# Altium schematic sheet led_RGB.SchDoc
size A4
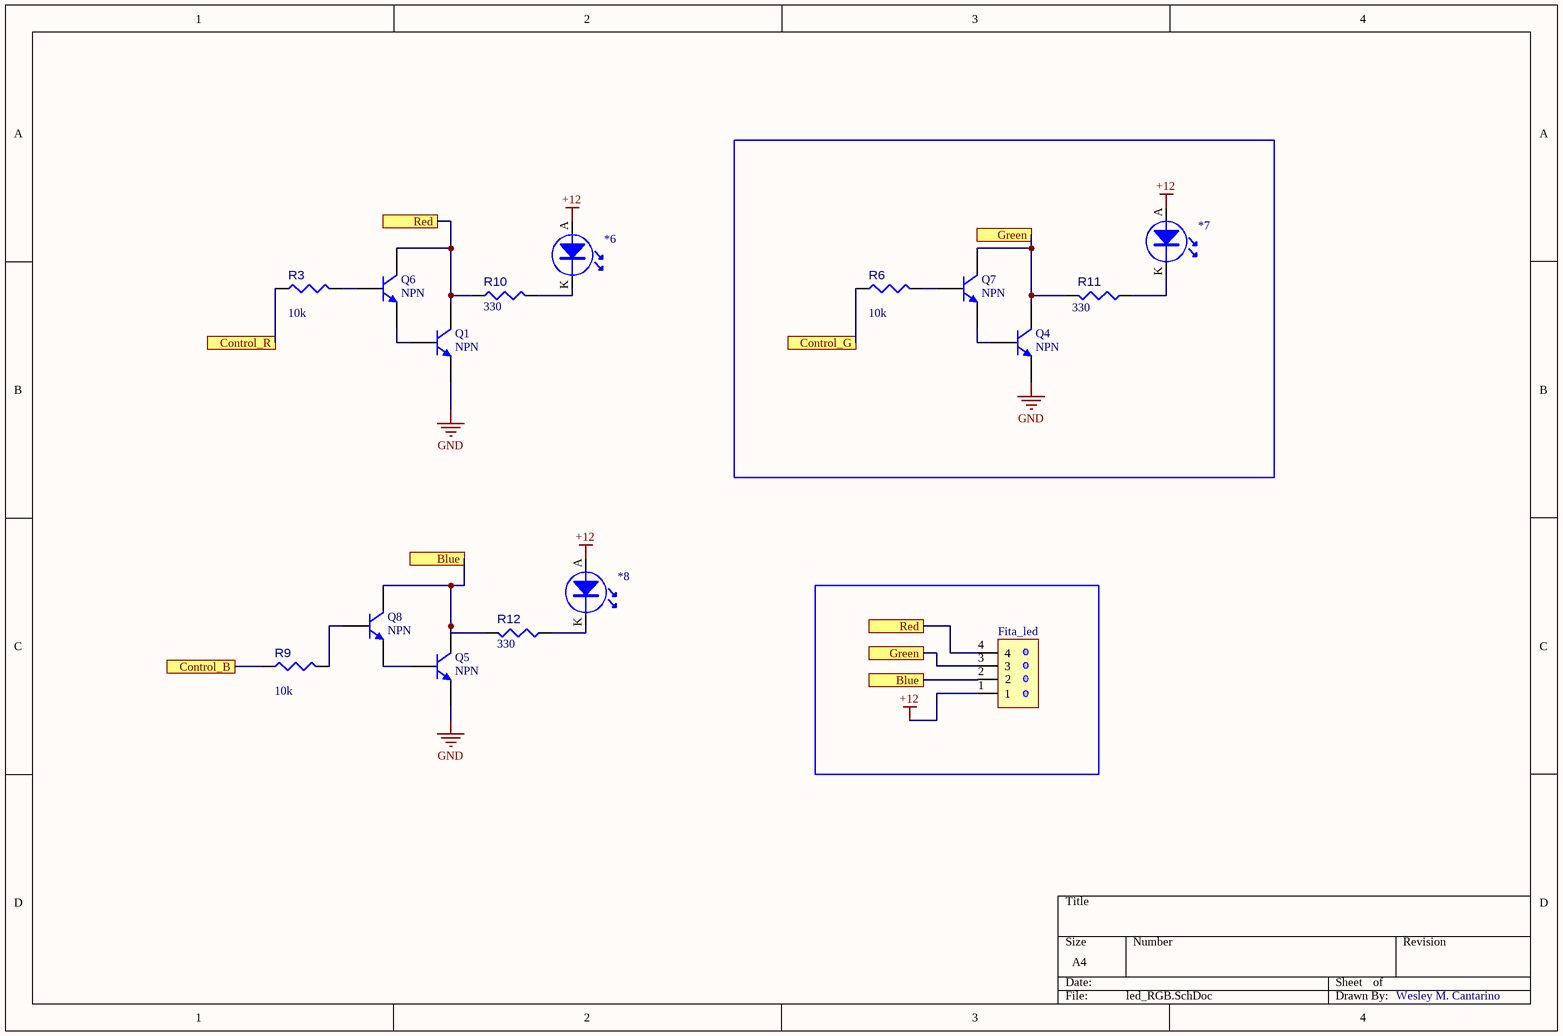
[diagram p0: led_RGB.SchDoc]

## Parts
*6  LED_AXIAL_5MM  [HEADER_1X2]  (value not drawn)
*7  LED_AXIAL_5MM  [HEADER_1X2]  (value not drawn)
*8  LED_AXIAL_5MM  [HEADER_1X2]  (value not drawn)
Fita_led  CN_KK_4  [CN_KK_4_5045-4]  (value not drawn)
Q1  NPN  [HEADER_1X3]
Q4  NPN  [HEADER_1X3]
Q5  NPN  [HEADER_1X3]
Q6  NPN  [HEADER_1X3]
Q7  NPN  [HEADER_1X3]
Q8  NPN  [HEADER_1X3]
R3  10k  [RES_PTH_7.62MM]
R6  10k  [RES_PTH_7.62MM]
R9  10k  [RES_PTH_7.62MM]
R10  330  [RES_PTH_7.62MM]
R11  330  [RES_PTH_7.62MM]
R12  330  [RES_PTH_7.62MM]

## Ports
Blue, Control_B, Control_G, Control_R, Green, Red

## Nets
+12: *6.A *7.A *8.A Fita_led.1
GND: Q1.3(E) Q4.3(E) Q5.3(E)
Blue: Fita_led.2 Q5.1(C) Q8.1(C) R12.2 ; port Blue
Control_B: R9.1 ; port Control_B
Control_G: R6.1 ; port Control_G
Control_R: R3.1 ; port Control_R
Green: Fita_led.3 Q4.1(C) Q7.1(C) R11.2 ; port Green
Red: Fita_led.4 Q1.1(C) Q6.1(C) R10.1 ; port Red
Net*6_K: *6.K R10.2
Net*7_K: *7.K R11.1
Net*8_K: *8.K R12.1
NetQ1_2: Q1.2(B) Q6.3(E)
NetQ4_2: Q4.2(B) Q7.3(E)
NetQ5_2: Q5.2(B) Q8.3(E)
NetQ6_2: Q6.2(B) R3.2
NetQ7_2: Q7.2(B) R6.2
NetQ8_2: Q8.2(B) R9.2

## Notes on the sheet
- Wesley M. Cantarino

## Library data of the parts
*6-*8 = LED_AXIAL_5MM: pin to pad: A>1 K>2; Value: ?
Fita_led = CN_KK_4: KK_4; Value: ?
Q1 Q4-Q8 = NPN: NPN Bipolar Transistor; pin to pad: 1>2 2>1; Published: 8-Jun-2000; LatestRevisionDate: 17-Jul-2002; LatestRevisionNote: Re-released for DXP Platform.; PackageReference: TO-226-AA; Publisher: Altium Limited; PackageDescription: TO, Flat Index; 3 In-Line, Axial Leads; Body Dia. 4.8mm; Leads 0.55 x 0.51 mm (max); Code_JEDEC: TO-226-AA
R3 R6 R9-R12 = RES_PTH_7.62MM: Pin Through Hole Resistor 7.62mm
  R3 R6 R9: Value: 10k
  R10-R12: Value: 330